# Altium schematic sheet Connectors.SchDoc
size A; DocumentNumber: 2; SheetNumber: 2; SheetTotal: 7
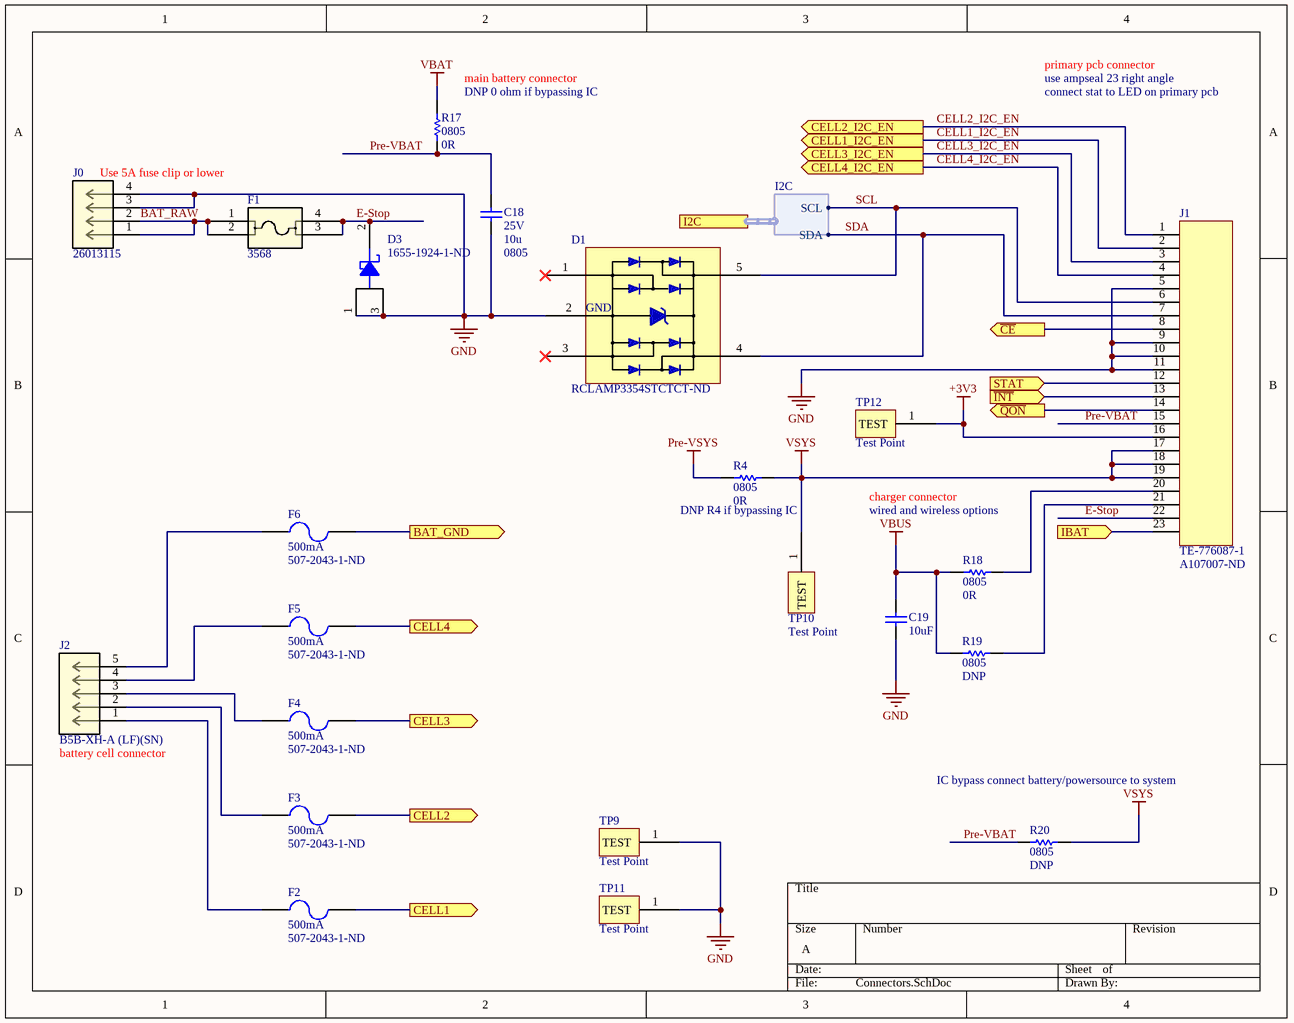
[diagram p0: Connectors.SchDoc]

## Parts
C18  Voltage - Rated: 25V  Capacitance: 10u  Package / Case: 0805  [C0805]  (hidden comment: GRM21BR61E106MA73L)
C19  Capacitance: 10uF  [C0603]  (hidden comment: Capacitor 0603)
D1  Supplier Part Number 1: RCLAMP3354STCTCT-ND  [SOT95P280X145-5N]  (hidden comment: RCLAMP3354S.TCT)
D3  1655-1924-1-ND  [50WQ06FNTR]
F1  3568  [3568_KEY]
F2  Current Rating: 500mA  Supplier Part Number 1: 507-2043-1-ND  [Bel Fuse Inc. 0679H0500-05]  (hidden comment: Bel Fuse Inc. 0679H0500-05)
F3  Current Rating: 500mA  Supplier Part Number 1: 507-2043-1-ND  [Bel Fuse Inc. 0679H0500-05]  (hidden comment: Bel Fuse Inc. 0679H0500-05)
F4  Current Rating: 500mA  Supplier Part Number 1: 507-2043-1-ND  [Bel Fuse Inc. 0679H0500-05]  (hidden comment: Bel Fuse Inc. 0679H0500-05)
F5  Current Rating: 500mA  Supplier Part Number 1: 507-2043-1-ND  [Bel Fuse Inc. 0679H0500-05]  (hidden comment: Bel Fuse Inc. 0679H0500-05)
F6  Current Rating: 500mA  Supplier Part Number 1: 507-2043-1-ND  [Bel Fuse Inc. 0679H0500-05]  (hidden comment: Bel Fuse Inc. 0679H0500-05)
J0  26013115  [CON_26013115]
J1  TE-776087-1  Supplier Part Number 1: A107007-ND  [TE-776087-1]
J2  B5B-XH-A (LF)(SN)  [CONN_B5B-XH-A (LF)(SN)_JST]
R4  Package / Case: 0805  Resistance: 0R  [RES0805]  (hidden comment: Resistor 0805)
R17  Package / Case: 0805  Resistance: 0R  [RES0805]  (hidden comment: Resistor 0805)
R18  Package / Case: 0805  Resistance: 0R  [RES0805]  (hidden comment: Resistor 0805)
R19  Package / Case: 0805  [RES0805]  (hidden comment: Resistor 0805)
R20  Package / Case: 0805  [RES0805]  (hidden comment: Resistor 0805)
TP9  Test Point  [TEST POINT]
TP10  Test Point  [TEST POINT]
TP11  Test Point  [TEST POINT]
TP12  Test Point  [TEST POINT]

## Ports
BAT_GND (out), CELL1 (out), CELL1_I2C_EN (out), CELL2 (out), CELL2_I2C_EN (out), CELL3 (out), CELL3_I2C_EN (out), CELL4 (out), CELL4_I2C_EN (out), I2C (harness I2C), IBAT (in), STAT (in), ~{CE} (out), ~{INT} (in), ~{QON} (out)

## Harnesses
I2C: SDA, SCL

## Nets
+3V3: J1.16 TP12.1(TEST)
GND: C18.1 C19.1 D1.2(GND) D3.1(ANODE) D3.3(ANODE) J0.3 J0.4 J1.5 J1.9 J1.10 J1.11 TP9.1(TEST) TP11.1(TEST)
Pre-VSYS: R4.2
VBAT: R17.2
VBUS: C19.2 R18.2 R19.1
VSYS: J1.17 J1.18 J1.19 R4.1 R20.2 TP10.1(TEST)
~{CE}: J1.8 ; port ~{CE}
~{INT}: J1.13 ; port ~{INT}
~{QON}: J1.14 ; port ~{QON}
BAT_GND: F6.2 ; port BAT_GND
BAT_RAW: F1.1 F1.2 J0.1 J0.2
CELL1: F2.2 ; port CELL1
CELL1_I2C_EN: J1.2 ; port CELL1_I2C_EN
CELL2: F3.2 ; port CELL2
CELL2_I2C_EN: J1.1 ; port CELL2_I2C_EN
CELL3: F4.2 ; port CELL3
CELL3_I2C_EN: J1.3 ; port CELL3_I2C_EN
CELL4: F5.2 ; port CELL4
CELL4_I2C_EN: J1.4 ; port CELL4_I2C_EN
E-Stop: D3.2(CATHODE) F1.3 F1.4 J1.22
IBAT: J1.23 ; port IBAT
Pre-VBAT: C18.2 J1.15 R17.1 R20.1
SCL: D1.5 J1.6 ; port I2C.SCL
SDA: D1.4 J1.7 ; port I2C.SDA
STAT: J1.12 ; port STAT
NetF2_1: F2.1 J2.1
NetF3_1: F3.1 J2.2
NetF4_1: F4.1 J2.3
NetF5_1: F5.1 J2.4
NetF6_1: F6.1 J2.5
NetJ1_20: J1.20 R18.1
NetJ1_21: J1.21 R19.2

Not connected (* = marked no-connect by the designer): D1 1* 3*

## Notes on the sheet
- (near R17) main battery connector
- (near R17) DNP 0 ohm if bypassing IC
- primary pcb connector
- use ampseal 23 right angle
- connect stat to LED on primary pcb
- (near J0) Use 5A fuse clip or lower
- charger connector
- (near R4) DNP R4 if bypassing IC
- wired and wireless options
- (near J2) battery cell connector
- IC bypass connect battery/powersource to system

## Library data of the parts
C18 = GRM21BR61E106MA73L: CAP SMD 10uF +/-20% 25V 0805; Tolerance: ±20%; Applications: General Purpose; Supplier 1: Digi-Key; Supplier Part Number 1: 490-10748-1-ND
C19 = Capacitor 0603: Multilayer Ceramic Capacitors (High dielectric type), 25V, 10 uF, ± 20 %, 0603, X5R, RoHS; Manufacturer: Taiyo Yuden; Manufacturer Part Number: TMK107BBJ106MA-T; Tolerance: 20%; Package / Case: 0603; Supplier 1: Digi-Key; Supplier Part Number 1: 587-6023-1-ND; RoHS: Yes; Category: Ceramic Capacitors; Stock 1: 152813; Pricing 1: 1=0.46000, 10=0.32000, 50=0.22380, 100=0.19180, 500=0.14386, 1000=0.12149 (USD); Mount: Surface Mount; Case/Package: 0603; Case Code (Imperial): 0603; Case Code (Metric): 1608; Min Operating Temperature: -55°C; Max Operating Temperature: 85°C; Packaging: Tape and Reel; Voltage Rating: 25V; Lead Free: Lead Free; RoHS Compliant: Yes; ComponentLink1URL: http://ds.yuden.co.jp/TYCOMPAS/ut/detail.do?productNo=TMK107BBJ106MA-T&fileName=TMK107BBJ106MA-T_SS&mode=specSheetDownload&src-supplier=Digi-Key; ComponentLink1Description: http://ds.yuden.co.jp/TYCOMPAS/ut/detail.do?productNo=TMK107BBJ106MA-T&fileName=TMK107BBJ106MA-T_SS&mode=specSheetDownload&src-supplier=Digi-Key
D1 = RCLAMP3354S.TCT: TVS DIODE 3.3VWM 16VC; Supplier 1: Digi-Key
D3 = 50WQ06FNTR: SCHOTTKY RECTIFIER 60V D-PAK
F1 = 3568: No Description Available; Mfr_Name: Keystone Electronics; Type: DEV; Copyright: Copyright (C) 2022 Ultra Librarian. All rights reserved.; Manufacturer_Part_Number: 3568; Digi-Key_Part_Number_1: 1528-2397-ND; Digi-Key_Part_Number_2: 36-3568-ND; RefDes: RefDes
F2-F6 = Bel Fuse Inc. 0679H0500-05: FUSE BRD MNT 500MA 350VAC 72VDC; Fuse Type Cartridge: Board Mount (Cartridge Style Excluded); Voltage Rating - AC: 350V; Voltage Rating - DC: 72V; Breaking Capacity @ Rated Voltage: 50A AC, 100A DC; Melting I²t: 0.08; Manufacturer Part Number: 0679H0500-05; Manufacturer: Bel Fuse Inc.; Supplier 1: Digi-Key
J0 = 26013115: Conn Power HDR 4 POS 4.2mm Solder RA Thru-Hole 4 Terminal 1 Port Bag; Mfr_Name: Molex Connector Corporation; Manufacturer: Molex; Current Rating: 13A; Voltage Rating: 600V; Number of Positions: 4; Number of Ports: 1; Row Spacing: 0.165inch; Copyright: Copyright (C) 2021 Ultra Librarian. All rights reserved.; Manufacturer_Part_Number: 26013115; RefDes: RefDes; Type: DEV; Supplier 1: Digi-Key; Supplier Part Number 1: WM13112-ND; Manufacturer Part Number: 26-01-3115; RoHS: Yes; Category: Headers and Wire Housings; Stock 1: 12454; Pricing 1: 1=1.30000, 10=1.07300, 100=0.89400, 1000=0.71518, 5000=0.62578, 10000=0.59449 (USD); Mount: Through Hole; Contact Plating: Gold; Contact Material: Brass; Material: Brass; Housing Material: Nylon; Color: Natural; Min Operating Temperature: -40°C; Max Operating Temperature: 105°C; Termination: Solder; Orientation: Right Angle; Number of Rows: 2; Contact Gender: Male; Packaging: Tray; Package Quantity: 1320; Number of Contacts: 4; Fastening Type: Ramp; Series: Mini-Fit® Jr™ 5569; Contact Type: Male Pin; Length: 9.6mm; Pitch: 4.2mm; Radiation Hardening: No; REACH SVHC: No SVHC; ELV: Compliant; Flammability Rating: UL94 V-2; ComponentLink1URL: https://datasheet.ciiva.com/6814/039301100-sd-6814020.pdf?src-supplier=Digi-Key; ComponentLink1Description: https://datasheet.ciiva.com/6814/039301100-sd-6814020.pdf?src-supplier=Digi-Key; ComponentLink2URL: https://datasheet.ciiva.com/30235/0026013115-pcb-headers-30235692.pdf?src-supplier=Onlinecomponents.com; ComponentLink2Description: https://datasheet.ciiva.com/30235/0026013115-pcb-headers-30235692.pdf?src-supplier=Onlinecomponents.com; ComponentLink3URL: https://datasheet.ciiva.com/16654/0026013115-pcb-headers-16654666.pdf?src-supplier=Avnet+Europe; ComponentLink3Description: https://datasheet.ciiva.com/16654/0026013115-pcb-headers-16654666.pdf?src-supplier=Avnet+Europe
J1 = TE-776087-1: CONN HDR RTANG 23POS W/GASKT TIN; Supplier 1: Digi-Key
J2 = B5B-XH-A (LF)(SN): No Description Available; Mfr_Name: JST; Copyright: Copyright (C) 2021 Ultra Librarian. All rights reserved.; Manufacturer_Part_Number: B5B-XH-A (LF)(SN); RefDes: RefDes; Type: DEV
R4 R17 R18 = Resistor 0805: Res Thick Film 0805 0 Ohm Jumper 1/8W Molded SMD Paper T/R; Manufacturer: Stackpole Electronics; Manufacturer Part Number: RMCF0805ZT0R00; Power Rating: 125mW; Supplier 1: Digi-Key; Supplier Part Number 1: RMCF0805ZT0R00CT-ND; RoHS: Yes; Category: Chip SMD Resistors; Stock 1: 3965473; Pricing 1: 1=0.10000, 10=0.01700, 25=0.01280, 50=0.00960, 100=0.00710, 250=0.00540, 500=0.00432, 1000=0.00318 (USD); Mount: Surface Mount; Case/Package: 0805; Case Code (Metric): 2012; Case Code (Imperial): 0805; Contact Plating: Tin,Matte; Size Code: 0805; Min Operating Temperature: -55°C; Max Operating Temperature: 155°C; Packaging: Tape and Reel; Resistor Type: Thick Film; Number of Terminations: 2; Max Power Dissipation: 125mW; Features: Automotive AEC-Q200; Series: RMCF; Construction: Rectangular; Length: 2mm; Width: 0.049inch; Height: 0.026inch; Depth: 1.25mm; Radiation Hardening: No; Lead Free: Lead Free; Military Standard: Not; RoHS Compliant: Yes; ComponentLink1URL: https://datasheet.ciiva.com/15193/getdatasheetpartid-360417-15193658.pdf?src-supplier=Verical; ComponentLink1Description: https://datasheet.ciiva.com/15193/getdatasheetpartid-360417-15193658.pdf?src-supplier=Verical
R19 R20 = Resistor 0805: DNP; Resistance: DNP